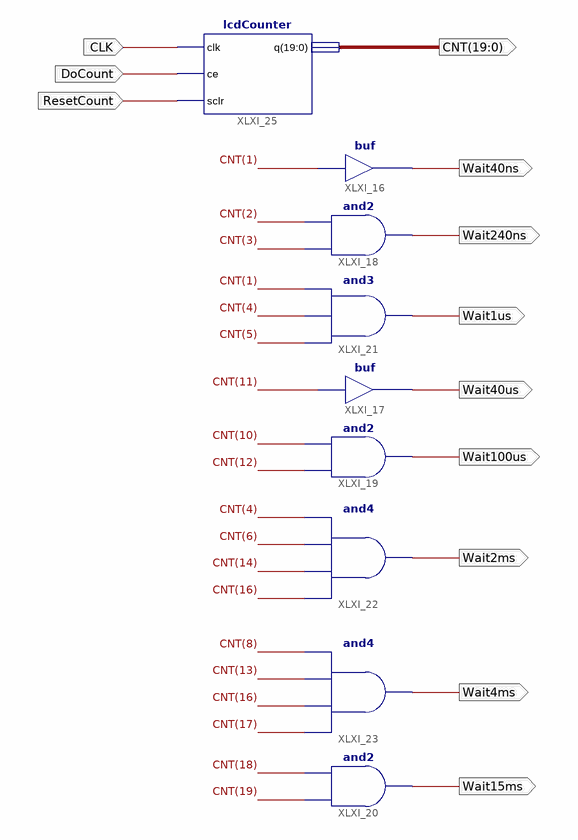
[diagram p0: schematic sheet 1]
// Xilinx ISE schematic timing.sch (spartan3e) as structural Verilog: 9 symbols, 12 ports
module timing (
  input  CLK,
  input  DoCount,
  input  ResetCount,
  output Wait240ns,
  output Wait40ns,
  output Wait1us,
  output Wait40us,
  output Wait100us,
  output Wait2ms,
  output Wait15ms,
  output Wait4ms,
  output [19:0] CNT
);

  buf XLXI_16 (Wait40ns, CNT[1]);
  and XLXI_18 (Wait240ns, CNT[3], CNT[2]);
  and XLXI_21 (Wait1us, CNT[5], CNT[4], CNT[1]);
  buf XLXI_17 (Wait40us, CNT[11]);
  and XLXI_19 (Wait100us, CNT[12], CNT[10]);
  and XLXI_22 (Wait2ms, CNT[16], CNT[14], CNT[6], CNT[4]);
  and XLXI_20 (Wait15ms, CNT[19], CNT[18]);
  and XLXI_23 (Wait4ms, CNT[17], CNT[16], CNT[13], CNT[8]);
  lcdCounter XLXI_25 (.clk(CLK), .ce(DoCount), .sclr(ResetCount), .q(CNT));
endmodule
